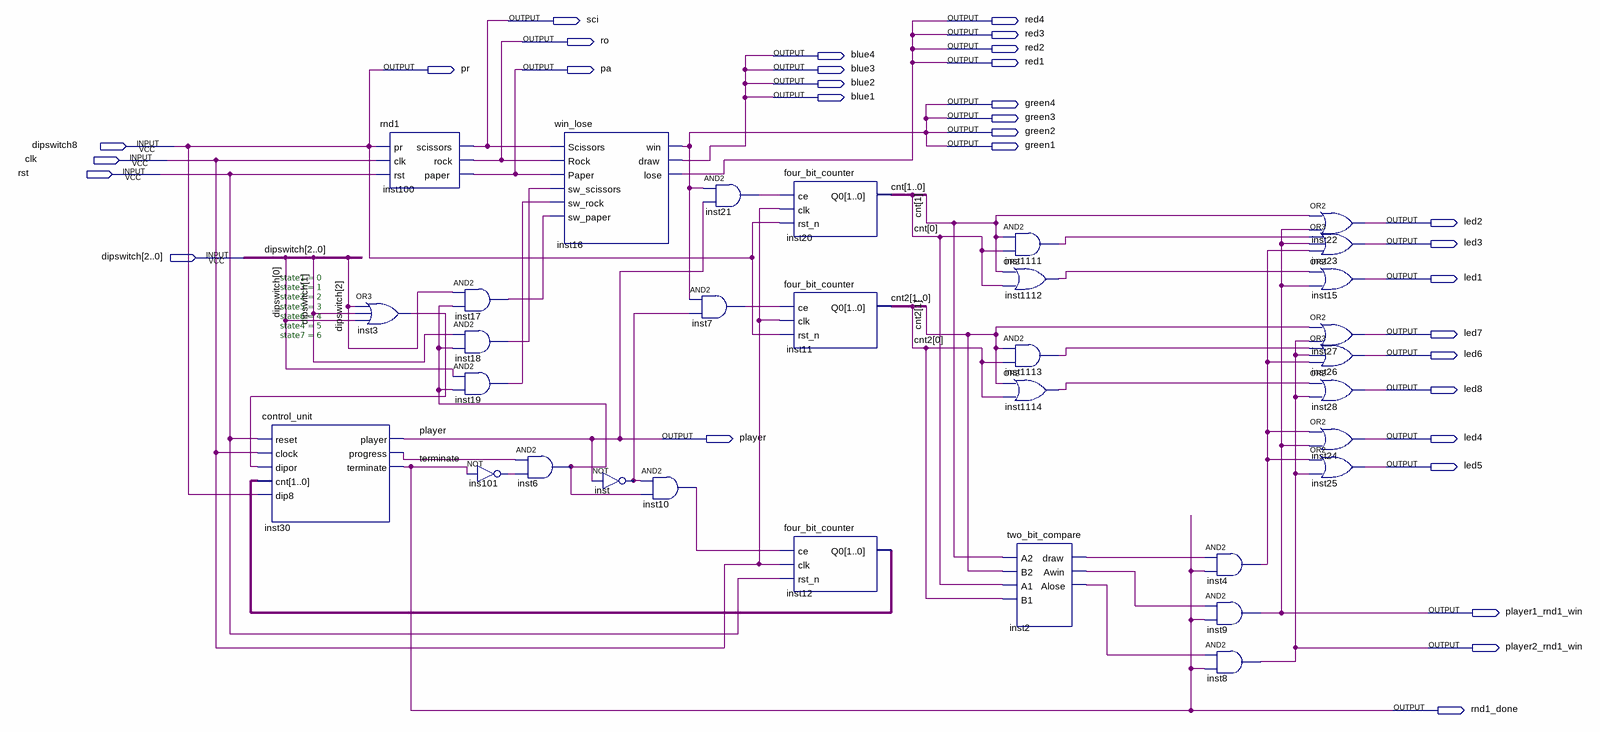
[diagram p0: schematic sheet]
// Quartus schematic project2.bdf as structural Verilog: 32 symbols, 32 pins
module project2 (
  input  dipswitch8,
  input  clk,
  input  rst,
  input  [2:0] dipswitch,
  output sci,
  output red4,
  output red3,
  output ro,
  output red2,
  output blue4,
  output red1,
  output pr,
  output pa,
  output blue3,
  output blue2,
  output blue1,
  output green4,
  output green3,
  output green2,
  output green1,
  output led2,
  output led3,
  output led1,
  output led7,
  output led6,
  output led8,
  output player,
  output led4,
  output led5,
  output player1_rnd1_win,
  output player2_rnd1_win,
  output rnd1_done
);

  wire ins101_out, inst2_alose, inst2_awin, inst2_draw, inst3_out, inst4_out, inst6_out, inst7_out,
       inst10_out, inst17_out, inst18_out, inst19_out, inst21_out, inst30_progress, inst1111_out,
       inst1112_out, inst1113_out, inst1114_out, inst_out;
  wire [1:0] cnt, cnt2, inst12_q0;

  control_unit #(.state1(0), .state3(1), .state2(2), .state5(3), .state6(4), .state4(5), .state7(6)) inst30 (
    .reset(rst), .clock(clk), .dipor(inst3_out), .cnt(inst12_q0), .dip8(dipswitch8), .player(player),
    .progress(inst30_progress), .terminate(rnd1_done));
  or inst3 (inst3_out, dipswitch[2], dipswitch[1], dipswitch[0]);
  rnd1 inst100 (.pr(dipswitch8), .clk(clk), .rst(rst), .scissors(sci), .rock(ro), .paper(pa));
  and inst17 (inst17_out, dipswitch[2], inst6_out);
  and inst18 (inst18_out, dipswitch[1], inst6_out);
  and inst19 (inst19_out, dipswitch[0], inst6_out);
  not ins101 (ins101_out, rnd1_done);
  and inst6 (inst6_out, inst30_progress, ins101_out);
  win_lose inst16 (
    .Scissors(sci), .Rock(ro), .Paper(pa), .sw_scissors(inst18_out), .sw_rock(inst19_out),
    .sw_paper(inst17_out), .win(green1), .draw(blue1), .lose(red1));
  not inst (inst_out, player);
  and inst10 (inst10_out, inst_out, inst6_out);
  and inst7 (inst7_out, green1, inst_out);
  and inst21 (inst21_out, green1, player);
  four_bit_counter inst20 (.ce(inst21_out), .clk(clk), .rst_n(dipswitch8), .Q0(cnt));
  four_bit_counter inst11 (.ce(inst7_out), .clk(clk), .rst_n(dipswitch8), .Q0(cnt2));
  four_bit_counter inst12 (.ce(inst10_out), .clk(clk), .rst_n(rst), .Q0(inst12_q0));
  and inst1111 (inst1111_out, cnt[1], cnt[0]);
  or inst1112 (inst1112_out, cnt[1], cnt[0]);
  and inst1113 (inst1113_out, cnt2[1], cnt2[0]);
  or inst1114 (inst1114_out, cnt2[1], cnt2[0]);
  two_bit_compare inst2 (
    .A2(cnt[1]), .B2(cnt2[1]), .A1(cnt[0]), .B1(cnt2[0]), .draw(inst2_draw), .Awin(inst2_awin),
    .Alose(inst2_alose));
  and inst4 (inst4_out, inst2_draw, rnd1_done);
  and inst9 (player1_rnd1_win, inst2_awin, rnd1_done);
  and inst8 (player2_rnd1_win, inst2_alose, rnd1_done);
  or inst22 (led2, cnt[1], player1_rnd1_win);
  or inst23 (led3, inst1111_out, player1_rnd1_win, inst4_out);
  or inst15 (led1, inst1112_out, player1_rnd1_win);
  or inst27 (led7, cnt2[1], player2_rnd1_win);
  or inst26 (led6, inst1113_out, player2_rnd1_win, inst4_out);
  or inst28 (led8, inst1114_out, player2_rnd1_win);
  or inst24 (led4, inst4_out, player1_rnd1_win);
  or inst25 (led5, inst4_out, player2_rnd1_win);

  assign blue2 = blue1;
  assign blue3 = blue1;
  assign blue4 = blue1;
  assign green2 = green1;
  assign green3 = green1;
  assign green4 = green1;
  assign pr = dipswitch8;
  assign red2 = red1;
  assign red3 = red1;
  assign red4 = red1;

  // Other names for the same wires on the sheet: terminate = rnd1_done
endmodule
